# Altium project AltiumWorkshop.PrjPcb
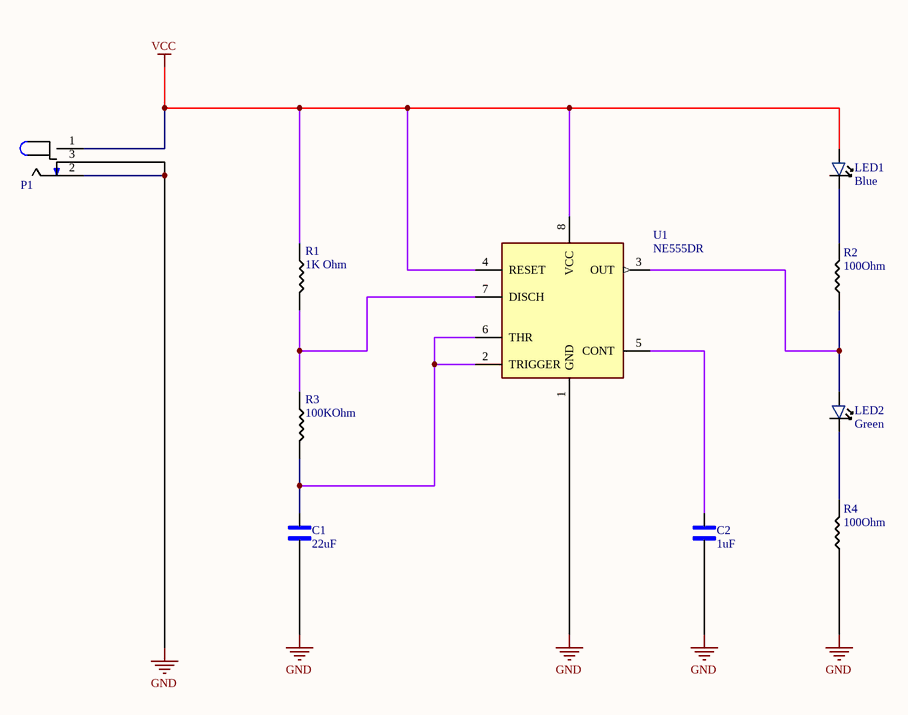
[diagram p0: Workshop_1.SchDoc]
1 sheet, 10 parts. Net scope: global (net labels, ports and power ports of the same name join across sheets).
Board file: PCB_1.PcbDoc

## Sheet Workshop_1.SchDoc
size A; SheetNumber: 1; SheetTotal: 1

### Parts
C1  22uF  [1206_Passive_Capacitor]
C2  1uF  [1206_Passive_Capacitor]
LED1  Blue  [LED_1206]
LED2  Green  [LED_1206]
P1  Power Jack  [Power_Jack]  (value not drawn)
R1  value 1K Ohm  [1206_Passive_Resitor]  (hidden comment: 1k)
R2  100Ohm  [1206_Passive_Resitor]
R3  100KOhm  [1206_Passive_Resitor]
R4  100Ohm  [1206_Passive_Resitor]
U1  NE555DR  [TS555IDTTR]

### Nets
GND: C1.1 C2.1 P1.2 P1.3 R4.1 U1.1(GND)
VCC: LED1.1 P1.1 R1.1 U1.4(RESET) U1.8(VCC)
NetC1_2: C1.2 R3.2 U1.2(TRIGGER) U1.6(THR)
NetC2_2: C2.2 U1.5(CONT)
NetLED1_2: LED1.2 R2.2
NetLED2_1: LED2.1 R2.1 U1.3(OUT)
NetLED2_2: LED2.2 R4.2
NetR1_2: R1.2 R3.1 U1.7(DISCH)

### Library data of the parts
C1 = C_22uF_1206: 22uF ±10% 25V X5R 1206 Multilayer Ceramic Capacitors MLCC - SMD/SMT RoHS; MFR Part #: CL31A226KAHNNNE; Type: basic; LCSC Part#: C12891; Datasheet: https://datasheet.lcsc.com/lcsc/1811031514_Samsung-Electro-Mechanics-CL31A226KAHNNNE_C12891.pdf; Value: 22uF
C2 = C_1uF_1206: MULTILAYER CERAMIC CAPACITORS MLCC - SMD/SMT 1UF 50V 1206 ROHS; MFR Part #: CL31B105KBHNNNE; Type: Basic; Digikey Link: https://www.digikey.com/product-detail/en/C1206C105M4RACTU/399-8150-1-ND/3471873/?itemSeq=304982366; LCSC Part#: C1848; Value: 1uF
LED1 = LED_BLUE_1206: blue 1206  Light Emitting Diodes (LED) ROHS; MFR Part #: NCD1206B1; Type: Extended; LCSC Part#: C130717; Datasheet: https://datasheet.lcsc.com/lcsc/2008201033_Foshan-NationStar-Optoelectronics-NCD1206B1_C130717.pdf; Value: Blue
LED2 = LED_GREEN_1206: Green 513~528nm 1206 Light Emitting Diodes (LED) RoHS; MFR Part #: SZYY1206G; Type: Extended; LCSC Part#: C434439; Datasheet: https://datasheet.lcsc.com/lcsc/2006301532_Yongyu-Photoelectric-SZYY1206G_C434439.pdf; Value: Green
P1 = P_Power Jack: Power Barrel Connector Jack 2.10mm ID (0.083"), 5.50mm OD (0.217") Through Hole, Right Angle; MFR Part #: PJ-102A; Value: CONN PWR JACK 2X5.5MM SOLDER; Digikey Link: https://www.digikey.com/product-detail/en/PJ-102A/CP-102A-ND/275425/?itemSeq=304982367; LCSC Part#: C136744; Type: Extended
R1 = R_1K_1206: CHIP RESISTOR - SURFACE MOUNT 1KOHMS ±1% 1/4W 1206 ROHS; MFR Part #: RNCP1206FTD1K00CT; Digikey Link: https://www.digikey.com/product-detail/en/RNCP1206FTD1K00/RNCP1206FTD1K00CT-ND/2240675/?itemSeq=304982373; LCSC Part#: C4410; Type: Basic
R2 R4 = R_100Ohm_1206: 100Ω ±1% 0.25W ±100ppm/℃ 1206 Chip Resistor - Surface Mount RoHS; MFR Part #: 1206W4F1000T5E; LCSC Part#: C17901; Datasheet: https://datasheet.lcsc.com/lcsc/2206010145_UNI-ROYAL-Uniroyal-Elec-1206W4F1000T5E_C17901.pdf; Type: Basic; Value: 100Ohm
R3 = R_100KOhm_1206: 100kΩ ±1% 0.25W ±100ppm/℃ 1206 Chip Resistor - Surface Mount RoHS; MFR Part #: 1206W4F1003T5E; LCSC Part#: C17900; Datasheet: https://datasheet.lcsc.com/lcsc/1810301421_UNI-ROYAL-Uniroyal-Elec-1206W4F1003T5E_C17900.pdf; Type: Basic; Value: 100KOhm
U1 = U_555_Slow: 555 Timer SOIC-8_150MIL ROHS 150ns Rise Time; MFR Part #: NE555DR; Digikey Link: https://www.digikey.com/product-detail/en/texas-instruments/NE555DR/296-6501-1-ND/372490; Type: Basic; LCSC Part#: C7593